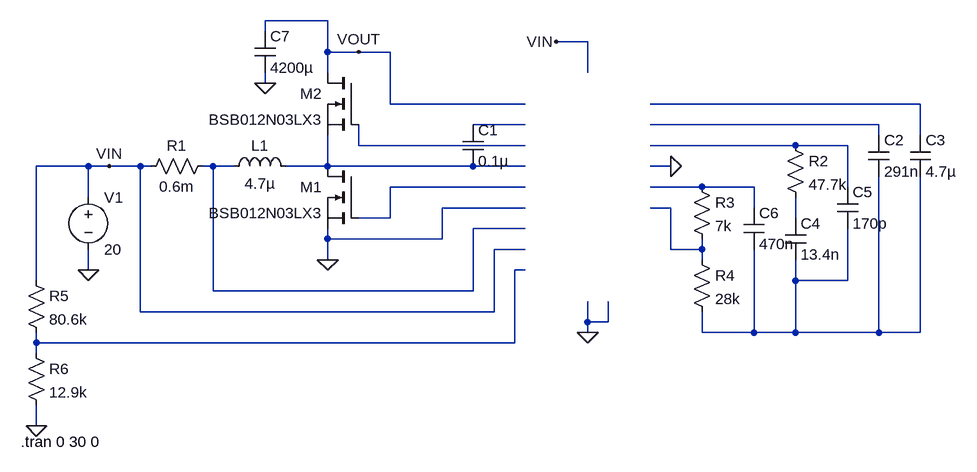
[diagram p0: schematic boost_converter.asc]
boost_converter.asc, the LTspice schematic file:
Version 4
SHEET 1 880 1060
WIRE -144 -96 -240 -96
WIRE -240 -80 -240 -96
WIRE 256 -64 208 -64
WIRE -144 -48 -144 -96
WIRE -96 -48 -144 -48
WIRE -48 -48 -96 -48
WIRE -144 -16 -144 -48
WIRE 256 -16 256 -64
WIRE -240 0 -240 -16
WIRE -48 32 -48 -48
WIRE 160 32 -48 32
WIRE 768 32 352 32
WIRE 160 64 80 64
WIRE 704 64 352 64
WIRE 704 80 704 64
WIRE 768 80 768 32
WIRE -96 96 -96 64
WIRE 160 96 -96 96
WIRE 576 96 352 96
WIRE 656 96 576 96
WIRE -512 128 -592 128
WIRE -480 128 -512 128
WIRE -432 128 -480 128
WIRE -416 128 -432 128
WIRE -320 128 -336 128
WIRE -288 128 -320 128
WIRE -144 128 -144 80
WIRE -144 128 -208 128
WIRE 80 128 -144 128
WIRE 160 128 80 128
WIRE 384 128 352 128
WIRE 160 160 -48 160
WIRE 432 160 352 160
WIRE 512 160 432 160
WIRE 656 160 656 96
WIRE -512 176 -512 128
WIRE 160 192 32 192
WIRE 384 192 352 192
WIRE 512 192 512 160
WIRE -48 208 -48 160
WIRE -48 208 -96 208
WIRE 576 208 576 176
WIRE 160 224 80 224
WIRE -144 240 -144 224
WIRE 32 240 32 192
WIRE 32 240 -144 240
WIRE 160 256 112 256
WIRE 384 256 384 192
WIRE 432 256 432 240
WIRE 432 256 384 256
WIRE -144 272 -144 240
WIRE 432 272 432 256
WIRE -512 288 -512 256
WIRE 160 288 144 288
WIRE -592 304 -592 128
WIRE 576 304 576 272
WIRE 656 304 656 224
WIRE 656 304 576 304
WIRE -320 320 -320 128
WIRE 80 320 80 224
WIRE 80 320 -320 320
WIRE -432 352 -432 128
WIRE 112 352 112 256
WIRE 112 352 -432 352
WIRE 256 368 256 336
WIRE 288 368 288 336
WIRE 288 368 256 368
WIRE 256 384 256 368
WIRE 432 384 432 352
WIRE 512 384 512 256
WIRE 512 384 432 384
WIRE 576 384 576 304
WIRE 576 384 512 384
WIRE 704 384 704 144
WIRE 704 384 576 384
WIRE 768 384 768 144
WIRE 768 384 704 384
WIRE -592 400 -592 384
WIRE 144 400 144 288
WIRE 144 400 -592 400
WIRE -592 416 -592 400
WIRE -592 528 -592 496
FLAG -512 288 0
FLAG -144 272 0
FLAG 256 384 0
FLAG -480 128 VIN
FLAG 208 -64 VIN
FLAG 384 128 0
FLAG -96 -48 VOUT
FLAG -240 0 0
FLAG -592 528 0
SYMBOL ind -304 144 R270
WINDOW 0 32 56 VTop 2
WINDOW 3 5 56 VBottom 2
SYMATTR InstName L1
SYMATTR Value 4.7µ
SYMATTR SpiceLine Ipk=75 Rser=2m
SYMBOL res -320 112 R90
WINDOW 0 0 56 VBottom 2
WINDOW 3 32 56 VTop 2
SYMATTR InstName R1
SYMATTR Value 0.6m
SYMBOL voltage -512 160 R0
WINDOW 123 0 0 Left 0
WINDOW 39 0 0 Left 0
SYMATTR InstName V1
SYMATTR Value 20
SYMBOL nmos -96 128 M0
SYMATTR InstName M1
SYMATTR Value BSB012N03LX3
SYMBOL nmos -96 -16 M0
SYMATTR InstName M2
SYMATTR Value BSB012N03LX3
SYMBOL cap 64 64 R0
SYMATTR InstName C1
SYMATTR Value 0.1µ
SYMBOL cap 688 80 R0
SYMATTR InstName C2
SYMATTR Value 291n
SYMBOL cap 752 80 R0
SYMATTR InstName C3
SYMATTR Value 4.7µ
SYMBOL res 560 80 R0
SYMATTR InstName R2
SYMATTR Value 47.7k
SYMBOL cap 560 208 R0
SYMATTR InstName C4
SYMATTR Value 13.4n
SYMBOL cap 640 160 R0
SYMATTR InstName C5
SYMATTR Value 170p
SYMBOL res 416 144 R0
SYMATTR InstName R3
SYMATTR Value 7k
SYMBOL res 416 256 R0
SYMATTR InstName R4
SYMATTR Value 28k
SYMBOL cap 496 192 R0
SYMATTR InstName C6
SYMATTR Value 470n
SYMBOL cap -256 -80 R0
SYMATTR InstName C7
SYMATTR Value 4200µ
SYMATTR SpiceLine Rser=2m
SYMBOL res -608 288 R0
SYMATTR InstName R5
SYMATTR Value 80.6k
SYMBOL res -608 400 R0
SYMATTR InstName R6
SYMATTR Value 12.9k
TEXT -616 552 Left 2 !.tran 0 30 0

The netlist it stands for:
* boost_converter.asc
L1 N006 N007 4.7µ Ipk=75 Rser=2m
R1 N006 VIN 0.6m
V1 VIN 0 20
M1 N007 N008 0 0 BSB012N03LX3
M2 VOUT N004 N007 N007 BSB012N03LX3
C1 N002 N007 0.1µ
C2 N003 N013 291n
C3 N001 N013 4.7µ
R2 N005 N011 47.7k
C4 N011 N013 13.4n
C5 N005 N013 170p
R3 N009 N010 7k
R4 N010 N013 28k
C6 N009 N013 470n
C7 VOUT 0 4200µ Rser=2m
R5 VIN N012 80.6k
R6 N012 0 12.9k
.model NMOS NMOS
.model PMOS PMOS
.lib standard.mos
.tran 0 30 0
.backanno
.end